# EAGLE design Power systems board REV2 (EAGLE 8.7.0)
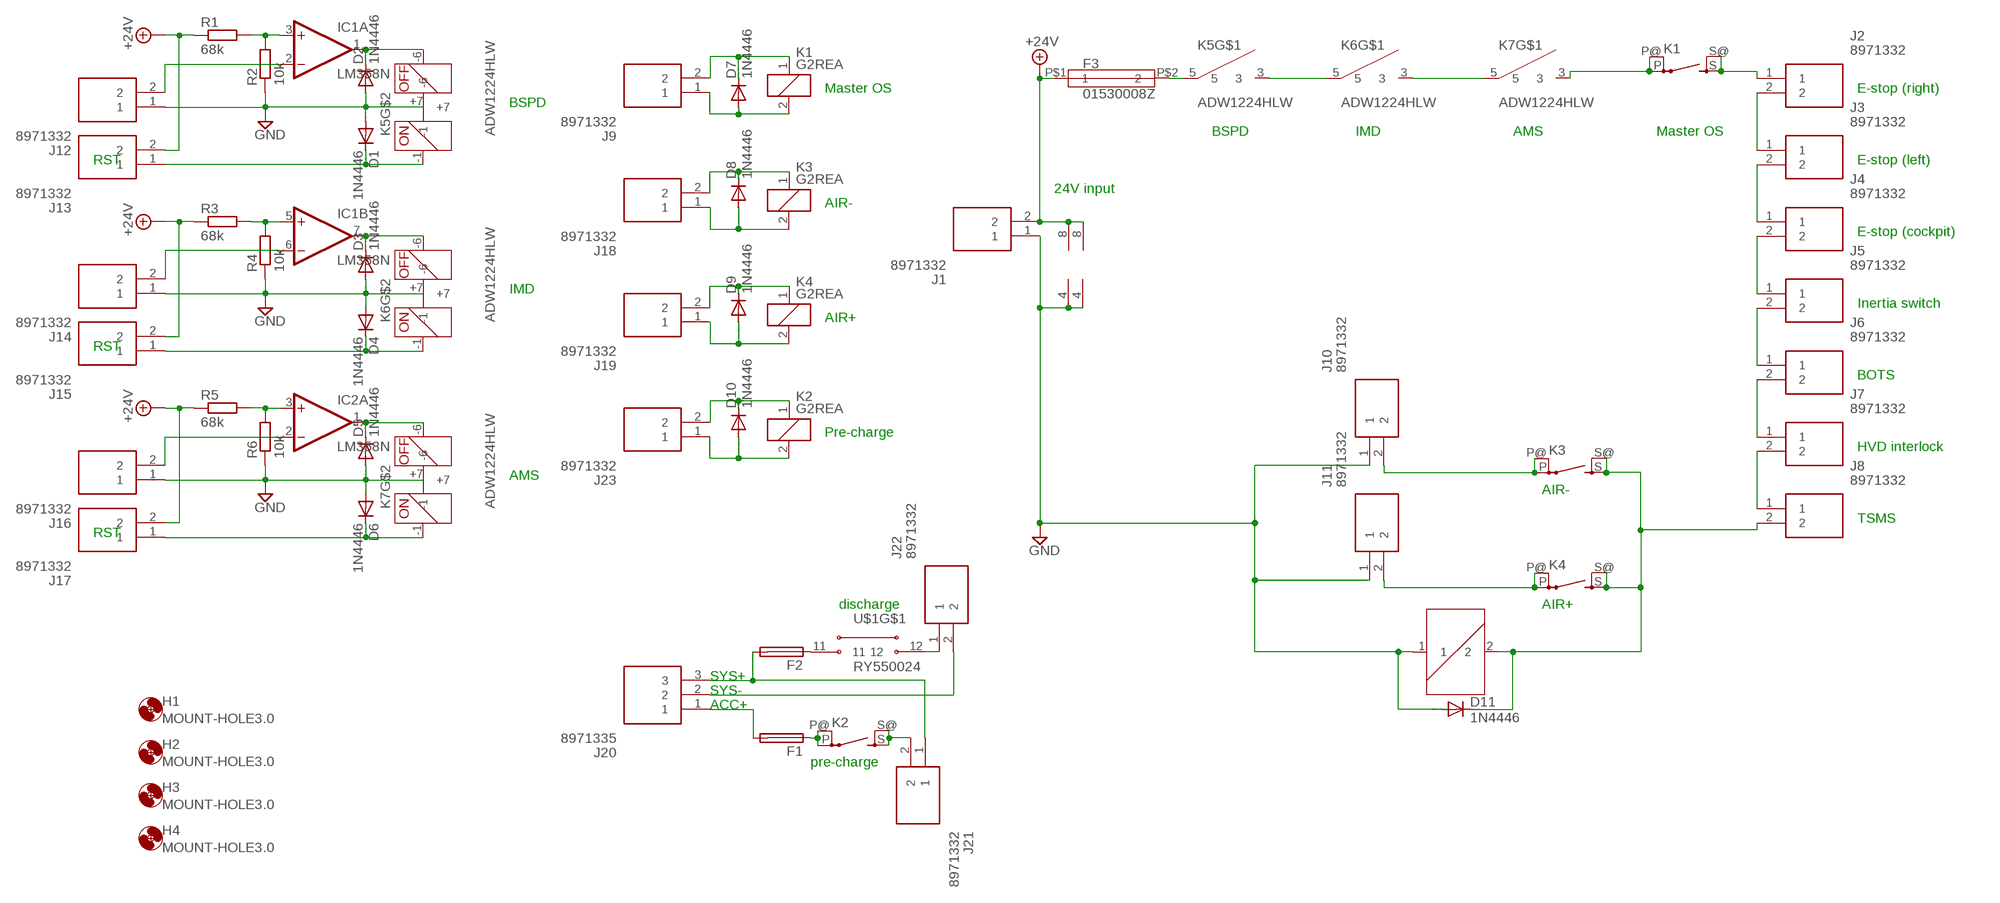
[diagram p0: schematic, sheet 1]

## Parts
D1  1N4446  [DO35-10]
D2  1N4446  [DO35-10]
D3  1N4446  [DO35-10]
D4  1N4446  [DO35-10]
D5  1N4446  [DO35-10]
D6  1N4446  [DO35-10]
D7  1N4446  [DO35-10]
D8  1N4446  [DO35-10]
D9  1N4446  [DO35-10]
D10  1N4446  [DO35-10]
D11  1N4446  [DO35-10]
F1  GSH15  [GSH15]
F2  GSH15  [GSH15]
F3  01530008Z  [01530008Z]
H1  MOUNT-HOLE3.0  [3,0]
H2  MOUNT-HOLE3.0  [3,0]
H3  MOUNT-HOLE3.0  [3,0]
H4  MOUNT-HOLE3.0  [3,0]
IC1  LM358N  [DIL08]
IC2  LM358N  [DIL08]
J1  8971332  [SHDR2W90P0X350_1X2_700X700X850]
J2  8971332  [SHDR2W90P0X350_1X2_700X700X850]
J3  8971332  [SHDR2W90P0X350_1X2_700X700X850]
J4  8971332  [SHDR2W90P0X350_1X2_700X700X850]
J5  8971332  [SHDR2W90P0X350_1X2_700X700X850]
J6  8971332  [SHDR2W90P0X350_1X2_700X700X850]
J7  8971332  [SHDR2W90P0X350_1X2_700X700X850]
J8  8971332  [SHDR2W90P0X350_1X2_700X700X850]
J9  8971332  [SHDR2W90P0X350_1X2_700X700X850]
J10  8971332  [SHDR2W90P0X350_1X2_700X700X850]
J11  8971332  [SHDR2W90P0X350_1X2_700X700X850]
J12  8971332  [SHDR2W90P0X350_1X2_700X700X850]
J13  8971332  [SHDR2W90P0X350_1X2_700X700X850]
J14  8971332  [SHDR2W90P0X350_1X2_700X700X850]
J15  8971332  [SHDR2W90P0X350_1X2_700X700X850]
J16  8971332  [SHDR2W90P0X350_1X2_700X700X850]
J17  8971332  [SHDR2W90P0X350_1X2_700X700X850]
J18  8971332  [SHDR2W90P0X350_1X2_700X700X850]
J19  8971332  [SHDR2W90P0X350_1X2_700X700X850]
J20  8971335  [SHDR3W90P0X350_1X3_1050X700X85]
J21  8971332  [SHDR2W90P0X350_1X2_700X700X850]
J22  8971332  [SHDR2W90P0X350_1X2_700X700X850]
J23  8971332  [SHDR2W90P0X350_1X2_700X700X850]
K1  G2REA  [G2REA]
K2  G2REA  [G2REA]
K3  G2REA  [G2REA]
K4  G2REA  [G2REA]
K5  ADW1224HLW  [ADW1224HLW]
K6  ADW1224HLW  [ADW1224HLW]
K7  ADW1224HLW  [ADW1224HLW]
R1  68k  R-EU_0204/7  [0204/7]
R2  10k  R-EU_0204/7  [0204/7]
R3  68k  R-EU_0204/7  [0204/7]
R4  10k  R-EU_0204/7  [0204/7]
R5  68k  R-EU_0204/7  [0204/7]
R6  10k  R-EU_0204/7  [0204/7]
U$1  RY550024  [RY550024]

## Nets
+24V: F3.P$1 IC1.8(P:V+) IC2.8(P:V+) J1.2 J13.2 J15.2 J17.2 R1.1 R3.1 R5.1
GND: D1.A D2.A D3.A D4.A D5.A D6.A D11.A IC1.4(P:V-) IC2.4(P:V-) J1.1 J10.1 J11.1 J12.1 J14.1 J16.1 K5.+7 K6.+7 K7.+7 R2.1 R4.1 R6.1 U$1.1
N$1: IC1.3(A:+IN) R1.2 R2.2
N$2: K5.3 K6.5
N$3: K6.3 K7.5
N$4: K1.P(2:P) K1.P@(2:P) K7.3
N$5: J2.1 K1.S(2:S) K1.S@(2:S)
N$6: J2.2 J3.1
N$7: J3.2 J4.1
N$8: J4.2 J5.1
N$9: J5.2 J6.1
N$10: J6.2 J7.1
N$11: J7.2 J8.1
N$12: D11.C J8.2 K3.S(2:S) K3.S@(2:S) K4.S(2:S) K4.S@(2:S) U$1.2
N$13: J10.2 K3.P(2:P) K3.P@(2:P)
N$14: J11.2 K4.P(2:P) K4.P@(2:P)
N$15: F1.1 K2.P(2:P) K2.P@(2:P)
N$16: D2.C IC1.1(A:OUT) K5.-6
N$17: IC1.2(A:-IN) J12.2
N$18: D1.C J13.1 K5.-1
N$19: IC1.5(B:+IN) R3.2 R4.2
N$20: IC1.6(B:-IN) J14.2
N$21: D5.C IC2.1(A:OUT) K7.-6
N$22: D4.C J15.1 K6.-1
N$23: D3.C IC1.7(B:OUT) K6.-6
N$24: D7.C J9.2 K1.1
N$25: IC2.2(A:-IN) J16.2
N$26: IC2.3(A:+IN) R5.2 R6.2
N$27: D7.A J9.1 K1.2
N$28: D6.C J17.1 K7.-1
N$29: D8.C J18.2 K3.1
N$30: D8.A J18.1 K3.2
N$31: D9.C J19.2 K4.1
N$32: D9.A J19.1 K4.2
N$33: F1.2 J20.1
N$34: F2.2 J20.3 J21.1
N$35: J21.2 K2.S(2:S) K2.S@(2:S)
N$36: J20.2 J22.2
N$37: D10.C J23.2 K2.1
N$38: D10.A J23.1 K2.2
N$39: F3.P$2 K5.5
N$40: F2.1 U$1.11
N$41: J22.1 U$1.12
Unconnected: IC2.5(B:+IN) IC2.6(B:-IN) IC2.7(B:OUT)

## Notes on the sheet
- Master OS | E-stop (right)
- BSPD
- BSPD | IMD | AMS | Master OS
- RST | E-stop (left)
- 24V input
- AIR-
- E-stop (cockpit)
- IMD
- Inertia switch
- AIR+
- RST
- BOTS
- Pre-charge
- HVD interlock
- AMS
- AIR-
- TSMS
- RST
- discharge | AIR+
- SYS+
- SYS-
- ACC+
- pre-charge

## Library data of the parts
D1-D11 = diode:1N4446: DIODE high speed (Philips)
F1 F2 = fuse:GSH15: FUSE HOLDER grid 15mm, 19649 Wickmann; MPN: 64900001039; OC_FARNELL: 1271673; OC_NEWARK: 02P0318
F3 = 01530008:01530008Z
H1-H4 = holes:MOUNT-HOLE: MOUNTING HOLE with drill center marker
IC1 = linear:LM358: OP AMP also LM158; LM258; LM2904 Source: http://cache.national.com/ds/LM/LM158.pdf; SPICEPREFIX: J
IC2 = linear:LM358: OP AMP also LM158; LM258; LM2904 Source: http://cache.national.com/ds/LM/LM158.pdf
J1-J19 J21-J23 = SamacSys_Parts:8971332: RS Pro 3.5mm Pitch Straight PCB Terminal Block with Screw Termination, PCB Mount, 2 Way Source: Datasheet <http://uk.rs-online.com/web/p/products/8971332>; ARROW_PART_NUMBER: 8971332; ARROW_PRICE/STOCK: http://uk.rs-online.com/web/p/products/8971332; DESCRIPTION: RS Pro 3.5mm Pitch Straight PCB Terminal Block with Screw Termination, PCB Mount, 2 Way; HEIGHT: 8.5mm; MANUFACTURER_NAME: RS Components; MANUFACTURER_PART_NUMBER: 8971332; RS_PART_NUMBER: 8971332; RS_PRICE/STOCK: http://uk.rs-online.com/web/p/products/8971332
J20 = SamacSys_Parts:8971335: 3.5mm U/low prof PCB terminal block,3P Source: Datasheet <http://docs-asia.electrocomponents.com/webdocs/157d/0900766b8157d678.pdf>; DESCRIPTION: 3.5mm U/low prof PCB terminal block,3P; HEIGHT: 8.5mm; MANUFACTURER_NAME: RS Components; MANUFACTURER_PART_NUMBER: 8971335; RS_PART_NUMBER: 8971335
K1-K4 = relay:G2REA: RELAY 1 x norm. open, high current, Omron; OC_FARNELL: unknown; OC_NEWARK: unknown
K5-K7 = ADW1224HLW:ADW1224HLW
R1-R6 = rcl:R-EU_: RESISTOR, European symbol; SPICEPREFIX: R
U$1 = RY550024:RY550024

## Board
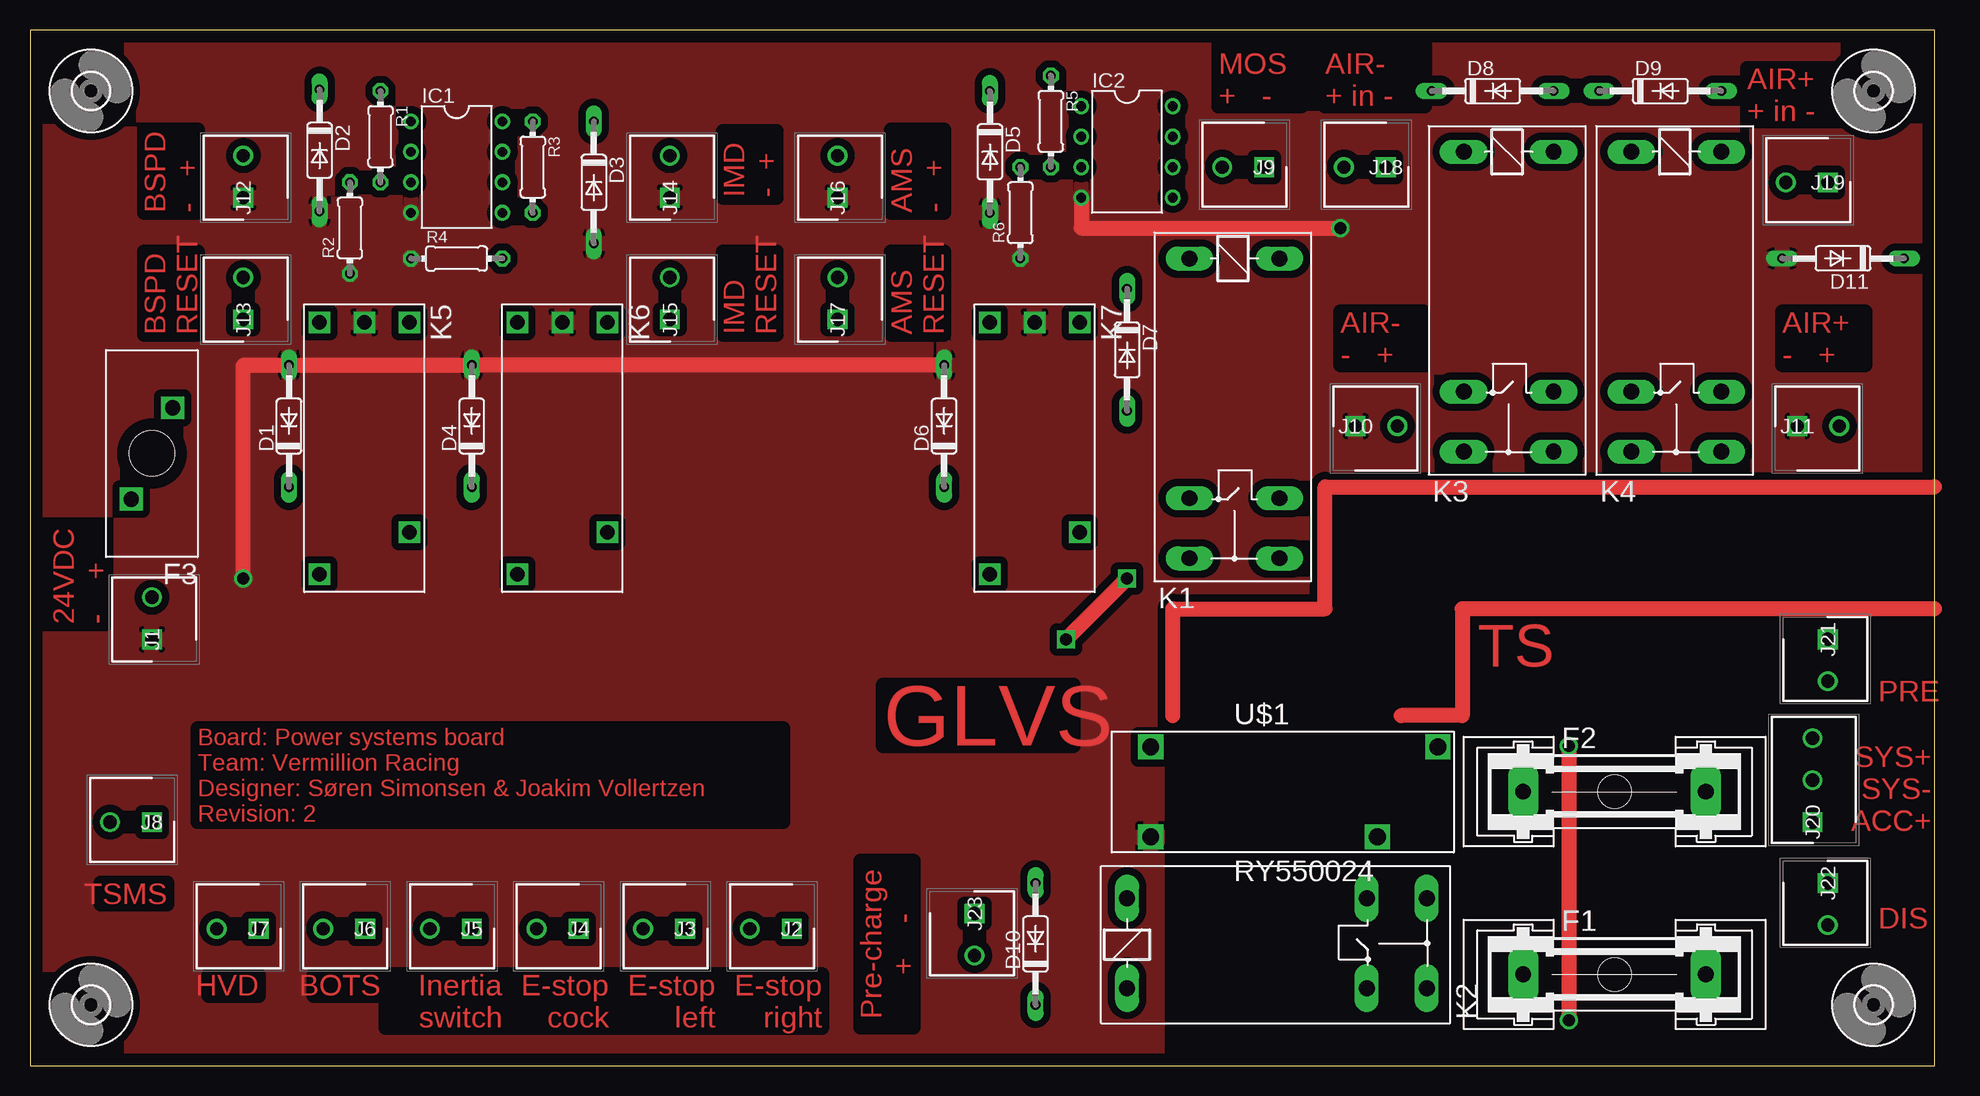
[diagram p1: board, top side]
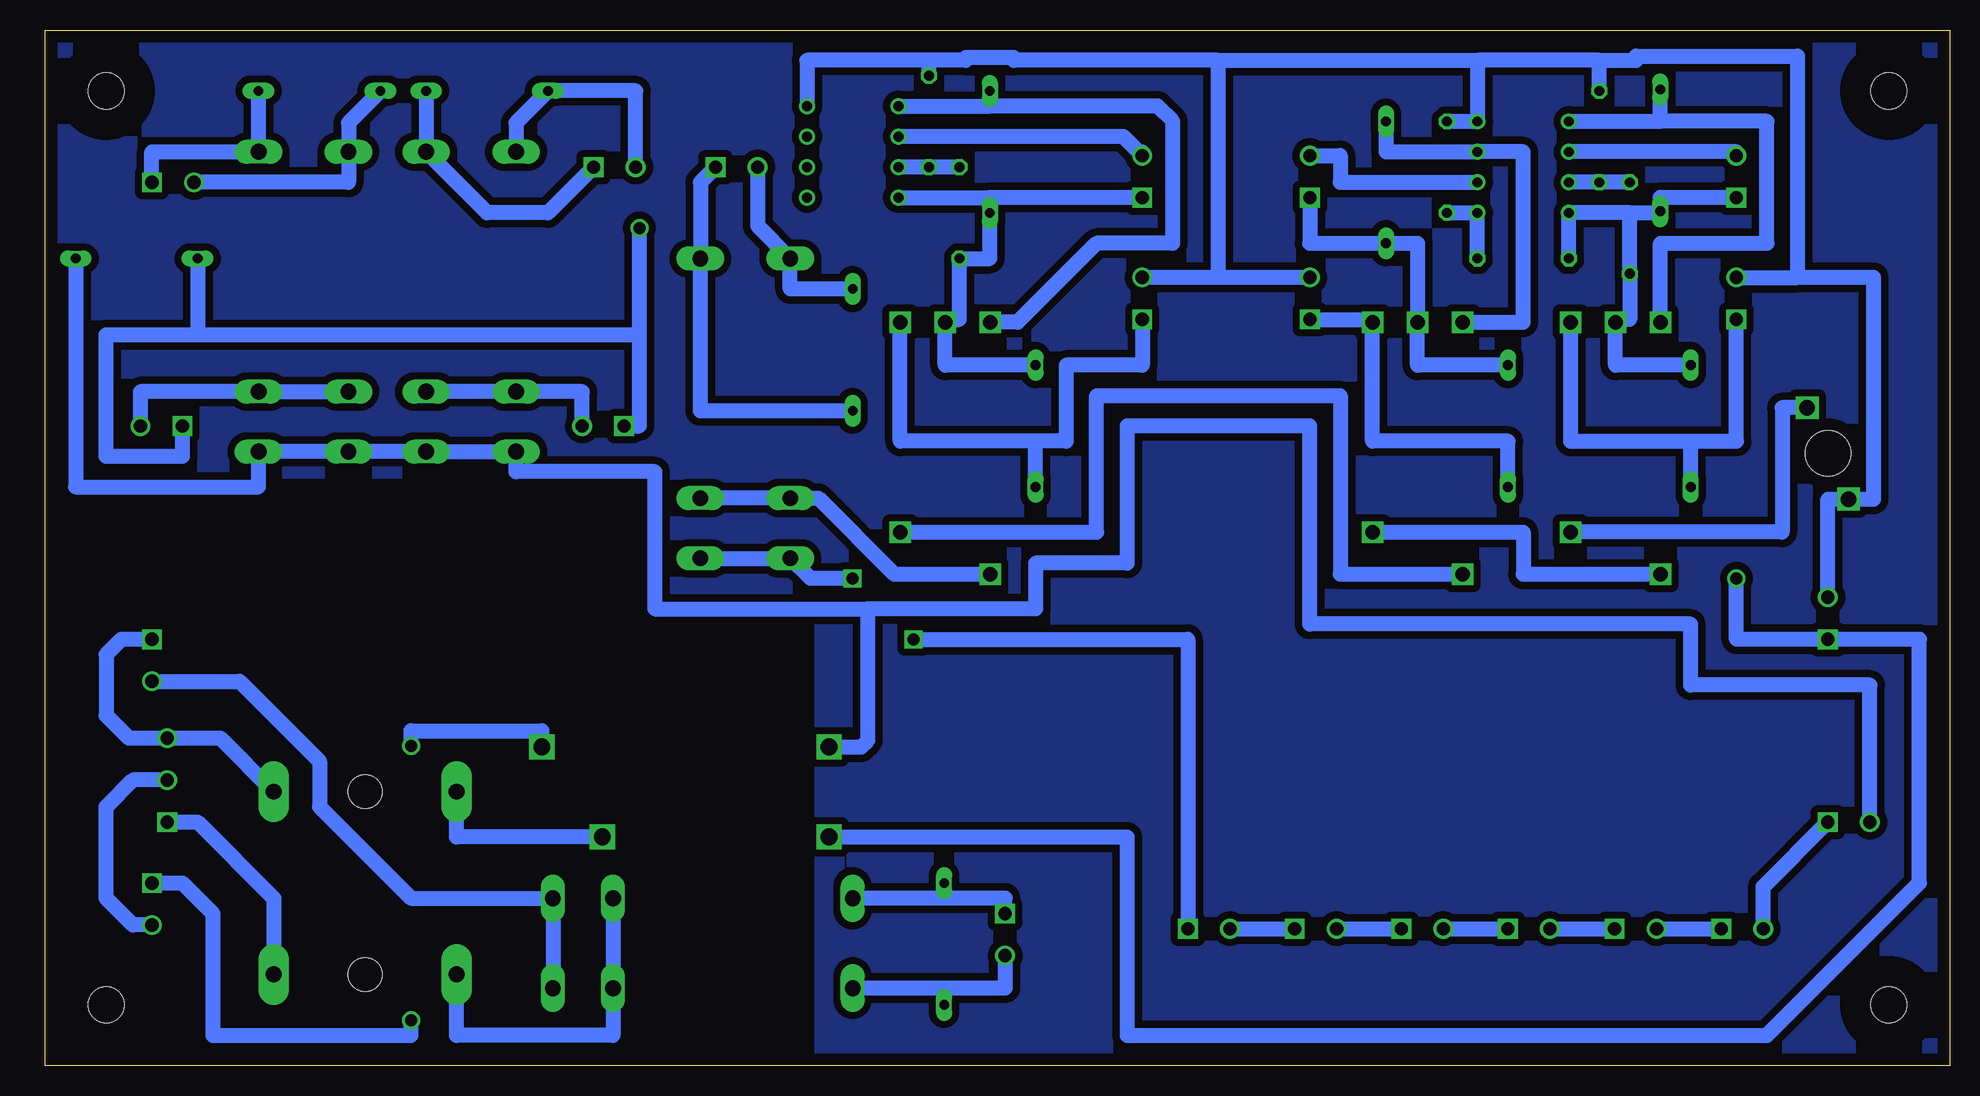
[diagram p2: board, bottom side, seen from below]

Size 158.75 x 86.36 mm. Coordinates in mm from the lower left corner, seen from the top.
Outline: 0,0 158.75,0 158.75,86.36 0,86.36 0,0
Copper layers (1*16): Top 0.035mm / dielectric 1.5mm / Bottom 0.035mm
Design rules "default *": minimum track width 6mil, minimum drill 0.35mm, track to track 24mil, track to pad 24mil, pad to pad 24mil, via to via 24mil, smd to smd 24mil, copper to edge 40mil, drill to drill 6mil, minimum pad ring 10mil, minimum via ring 8mil, stop-mask expansion 4mil, vias tented up to drill 0mil, thermal gap 10mil

### Footprints (pad centres in the part's own frame; a part is rotated, then mirrored left to right if it is on the bottom)
DO35-10 = drill 0.813 long: A 5.08,0; C -5.08,0
GSH15 = drill 1.321 pad 2.54 long: 1 -7.62,0; 2 7.62,0 | hole 2.794: 0,0
01530008Z = drill 1.27 square: P$1 5.537,12.446; P$2 2.083,4.826 | hole 3.785: 3.81,8.636
3,0 = hole 3: 0,0
DIL08 = drill 0.813 pad 1.27: 1 -3.81,-3.81; 2 -1.27,-3.81; 3 1.27,-3.81; 4 3.81,-3.81; 5 3.81,3.81; 6 1.27,3.81; 7 -1.27,3.81; 8 -3.81,3.81
SHDR2W90P0X350_1X2_700X700X850 = drill 1.1 pad 1.65 square: 1 0,0 | drill 1.1 pad 1.65: 2 3.5,0
SHDR3W90P0X350_1X3_1050X700X85 = drill 1.1 pad 1.65 square: 1 0,0 | drill 1.1 pad 1.65: 2 3.5,0; 3 7,0
G2REA = drill 1.321 long: 1 -2.54,-3.683; 2 -2.54,3.81; P 17.45,-3.683; P@ 17.45,3.81; S 22.454,-3.683; S@ 22.454,3.81
ADW1224HLW = drill 1.2 square: 3 22.5,1.25; 5 19,8.75; +7 1.5,5; -1 1.5,8.75; -6 1.5,1.25
0204/7 = drill 0.813 octagon: 1 -3.81,0; 2 3.81,0
RY550024 = drill 1.4 square: 1 3.25,1.3; 2 3.25,8.8; 11 22.15,1.3; 12 27.19,8.8

### Placement (x,y rotation side)
D1  21.59,53.34 90 top
D2  24.13,76.33 270 top
D3  46.99,73.66 270 top
D4  36.83,53.34 90 top
D5  80.01,76.2 270 top
D6  76.2,53.34 90 top
D7  91.44,59.69 270 top
D8  121.92,81.28 0 top
D9  135.89,81.28 0 top
D10  83.82,10.16 90 top
D11  151.13,67.31 180 top
F1  132.08,7.62 0 top
F2  132.08,22.86 0 top
F3  13.97,59.69 180 top
H1  5.08,5.08 0 top
H2  5.08,81.28 0 top
H3  153.67,81.28 0 top
H4  153.67,5.08 0 top
IC1  35.56,74.93 270 top
IC2  91.44,76.2 270 top
J1  10.16,35.56 90 top
J2  63.5,11.43 180 top
J3  54.61,11.43 180 top
J4  45.72,11.43 180 top
J5  36.83,11.43 180 top
J6  27.94,11.43 180 top
J7  19.05,11.43 180 top
J8  10.16,20.32 180 top
J9  102.87,74.93 180 top
J10  110.49,53.34 0 top
J11  147.32,53.34 0 top
J12  17.78,72.39 90 top
J13  17.78,62.23 90 top
J14  53.34,72.39 90 top
J15  53.34,62.23 90 top
J16  67.31,72.39 90 top
J17  67.31,62.23 90 top
J18  113.03,74.93 180 top
J19  149.86,73.66 180 top
J20  148.59,20.32 90 top
J21  149.86,35.56 270 top
J22  149.86,15.24 270 top
J23  78.74,12.7 270 top
K1  100.33,64.77 270 top
K2  93.98,10.16 0 top
K3  123.19,73.66 270 top
K4  137.16,73.66 270 top
K5  22.86,63.5 270 top
K6  39.37,63.5 270 top
K7  78.74,63.5 270 top
R1  29.21,77.47 270 top
R2  26.67,69.85 90 top
R3  41.91,74.93 270 top
R4  35.56,67.31 0 top
R5  85.09,78.74 270 top
R6  82.55,71.12 90 top
U$1  90.17,17.78 0 top

### Tracks (layer width: path | path; a pad name or v marks a point on that pad's centre or on a via)
+24V
  Bottom 1.27: R1.1 29.21,83.82 | 39.37,83.82 IC1.8 R3.1 | 29.21,83.82 39.37,83.82 | R5.1 85.09,83.82 | IC2.8 95.25,83.82 85.09,83.82 | 60.96,83.82 39.37,83.82 | J13.2 12.7,65.73 | J15.2 60.96,65.73 | 60.96,65.73 J17.2 | 60.96,65.73 60.96,83.82 | J1.2 10.16,47.24 F3.P$1 6.35,47.24 6.35,65.73 12.7,65.73 | 29.21,83.82 26.14,83.82 26.14,84.18 12.7,84.18 12.7,65.73 | 60.96,83.82 78,83.82 78,84.05 82.02,84.05 82.02,83.82 85.09,83.82
GLVS
  Top 1.27: 95.25,29.21 95.25,38.1 107.95,38.1 107.95,48.26 158.75,48.26
GND  (via drill 1)
  Top 1.27: D6.A D4.A D1.A 17.78,58.42 v17.78,40.64 | IC2.4 87.63,69.85 v109.22,69.85
  Bottom 1.27: 26.67,71.12 R2.1 26.67,62.23 27.86,62.23 K5.+7 27.86,58.42 D1.A | 26.67,71.12 IC1.4 R4.1 | J14.1 53.34,68.58 D3.A 44.37,68.58 K6.+7 44.37,58.42 D4.A | D6.A 83.74,58.42 K7.+7 83.74,62.23 82.55,62.23 R6.1 80.01,67.31 D5.A 80.01,72.39 | v17.78,40.64 17.78,35.56 J1.1 2.54,35.56 2.54,15.24 15.24,2.54 68.58,2.54 68.58,19.08 U$1.1 | J10.1 109.22,53.34 109.22,60.96 | 109.22,60.96 v109.22,69.85 | J11.1 147.32,50.8 153.67,50.8 153.67,60.96 146.05,60.96 | J12.1 24.13,72.39 D2.A 24.13,71.12 26.67,71.12 | D11.A 146.05,60.96 | J16.1 80.01,72.39 | IC2.4 80.01,72.39 | 146.05,60.96 109.22,60.96
  pour Top: -1.27,-1.27 93.98,-1.27 93.98,38.1 107.95,38.1 107.95,49.53 160.02,49.53 160.02,87.63 -1.27,87.63
GND1
  pour Bottom: -1.27,-1.27 93.98,-1.27 93.98,38.1 107.95,38.1 107.95,49.53 160.02,49.53 160.02,87.63 -1.27,87.63
N$1
  Bottom 1.27: IC1.3 R1.2 R2.2
N$2
  Bottom 1.27: K5.3 35.56,41 35.56,44.5 K6.5
N$3
  Bottom 1.27: K7.5 71.12,44.5 71.12,55.88 50.8,55.88 50.8,41 K6.3
N$4
  Bottom 1.27: K1.P@ K1.P 94.31,47.32 87.99,41 K7.3
N$5  (via drill 1)
  Top 1.27: v86.36,35.56 v91.44,40.64
  Bottom 1.27: K1.S@ K1.S 94.97,40.64 v91.44,40.64 | v86.36,35.56 63.5,35.56 J2.1
N$6
  Bottom 1.27: J2.2 J3.1
N$7
  Bottom 1.27: J3.2 J4.1
N$8
  Bottom 1.27: J4.2 J5.1
N$9
  Bottom 1.27: J5.2 J6.1
N$10
  Bottom 1.27: J6.2 J7.1
N$11
  Bottom 1.27: J7.2 15.55,14.93 J8.1
N$12
  Bottom 1.27: J8.2 6.66,31.75 21.59,31.75 21.59,36.83 53.34,36.83 53.34,53.34 68.58,53.34 68.58,41.91 76.2,41.91 76.2,38.1 90.17,38.1 | D11.C 156.21,48.26 140.97,48.26 K4.S@ K4.S K3.S@ K3.S 119.51,49.53 107.95,49.53 107.95,38.1 90.17,38.1 | 90.17,38.1 90.17,27.14 90.73,26.58 U$1.2
N$13
  Bottom 1.27: K3.P@ K3.P 113.99,56.21 J10.2
N$14
  Bottom 1.27: K4.P K4.P@ 150.82,56.21 J11.2
N$15
  Bottom 1.27: K2.P@ K2.P 111.43,2.54 124.46,2.54 F1.1
N$16
  Bottom 1.27: IC1.1 24.13,78.74 | 24.13,78.74 D2.C | 24.13,78.74 15.24,78.74 15.24,68.58 24.11,68.58 K5.-6
N$17
  Bottom 1.27: J12.2 17.78,76.2 IC1.2
N$18
  Bottom 1.27: K5.-1 31.61,52.07 21.59,52.07 | J13.1 17.78,52.07 21.59,52.07 | D1.C 21.59,52.07
N$19
  Bottom 1.27: R3.2 IC1.5 R4.2
N$20
  Bottom 1.27: J14.2 50.8,75.89 50.8,73.66 IC1.6
N$21
  Bottom 1.27: IC2.1 80.01,80.01 | 80.01,80.01 D5.C | K7.-6 77.7,62 71.12,68.58 64.77,68.58 64.77,78.74 66.04,80.01 80.01,80.01
N$22
  Bottom 1.27: J15.1 48.12,62.23 K6.-1 48.12,52.07 36.83,52.07 D4.C
N$23
  Bottom 1.27: D3.C 46.99,76.2 IC1.7 35.56,76.2 35.56,62 K6.-6
N$24
  Bottom 1.27: D7.C 96.65,64.77 K1.1 99.37,70.03 J9.2
N$25
  Bottom 1.27: 67.31,76.2 J16.2 68.89,77.47 IC2.2
N$26
  Bottom 1.27: R6.2 R5.2 IC2.3
N$27
  Bottom 1.27: D7.A 104.14,54.61 K1.2 104.14,73.66 J9.1
N$28
  Bottom 1.27: K7.-1 87.49,52.07 76.2,52.07 | D6.C 76.2,52.07 | J17.1 67.31,58.42 73.66,58.42 73.66,52.07 76.2,52.07
N$29
  Bottom 1.27: J18.2 109.53,81.28 D8.C 119.51,78.61 K3.1
N$30
  Bottom 1.27: J18.1 116.84,71.12 121.92,71.12 K3.2 D8.A
N$31
  Bottom 1.27: J19.2 133.48,73.66 K4.1 133.48,78.61 D9.C
N$32
  Bottom 1.27: J19.1 149.86,76.2 K4.2 D9.A
N$33
  Bottom 1.27: J20.1 146.05,20.32 139.7,13.97 F1.2
N$34
  Bottom 1.27: F2.2 144.16,27.32 J20.3 151.78,27.32 153.67,29.21 153.67,34.29 152.4,35.56 J21.1
N$35
  Bottom 1.27: K2.S K2.S@ 128.27,13.97 135.89,21.59 135.89,25.4 142.55,32.06 J21.2
N$36
  Bottom 1.27: J20.2 151.44,23.82 153.67,21.59 153.67,13.97 151.44,11.74 J22.2
N$37
  Bottom 1.27: D10.C 83.82,6.48 | 83.82,6.48 K2.1 | J23.2 78.74,6.48 83.82,6.48
N$38
  Bottom 1.27: D10.A 83.82,13.97 | 83.82,13.97 K2.2 | J23.1 78.74,13.97 83.82,13.97
N$39
  Bottom 1.27: F3.P$2 13.97,54.86 13.97,44.5 K5.5
N$40
  Bottom 1.27: U$1.11 124.46,19.08 F2.1
N$41  (via drill 1)
  Top 1.27: v128.27,26.67 v128.27,3.81
  Bottom 1.27: v128.27,3.81 128.27,2.54 144.78,2.54 144.78,12.7 147.32,15.24 J22.1 | v128.27,26.67 128.27,27.94 117.36,27.94 U$1.12
TS
  Top 1.27: 158.75,38.1 119.38,38.1 119.38,29.21 114.3,29.21

### Text on the board
Top: MOS / + - | AIR- / + in - | AIR+ / + in - | IMD / - + | BSPD / - + | AMS / - + | BSPD / RESET | IMD / RESET | AMS / RESET | AIR- / - + | AIR+ / - + | 24VDC / - + | TS | PRE | GLVS | SYS+ / SYS- / ACC+ | Board: Power systems board / Team: Vermillion Racing / Designer: Søren Simonsen & Joakim Vollertzen / Revision: 2 | TSMS | DIS | Pre-charge / + - | HVD | BOTS | Inertia / switch | E-stop / cock | E-stop / left | E-stop / right